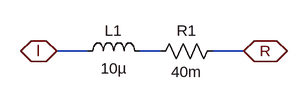
[diagram p0: schematic My_inductor.asc]
My_inductor.asc, the LTspice schematic file:
Version 4
SHEET 1 880 680
WIRE 112 128 64 128
WIRE 224 128 192 128
WIRE 352 128 304 128
FLAG 64 128 l
IOPIN 64 128 BiDir
FLAG 352 128 R
IOPIN 352 128 BiDir
SYMBOL ind 96 144 R270
WINDOW 0 32 56 VTop 2
WINDOW 3 5 56 VBottom 2
SYMATTR InstName L1
SYMATTR Value 10µ
SYMBOL res 320 112 R90
WINDOW 0 0 56 VBottom 2
WINDOW 3 32 56 VTop 2
SYMATTR InstName R1
SYMATTR Value 40m

The netlist it stands for:
* My_inductor.asc
L1 l N001 10µ
R1 R N001 40m
.backanno
.end